# EAGLE design PGTN018_phase_shifter (EAGLE 8.5.2)
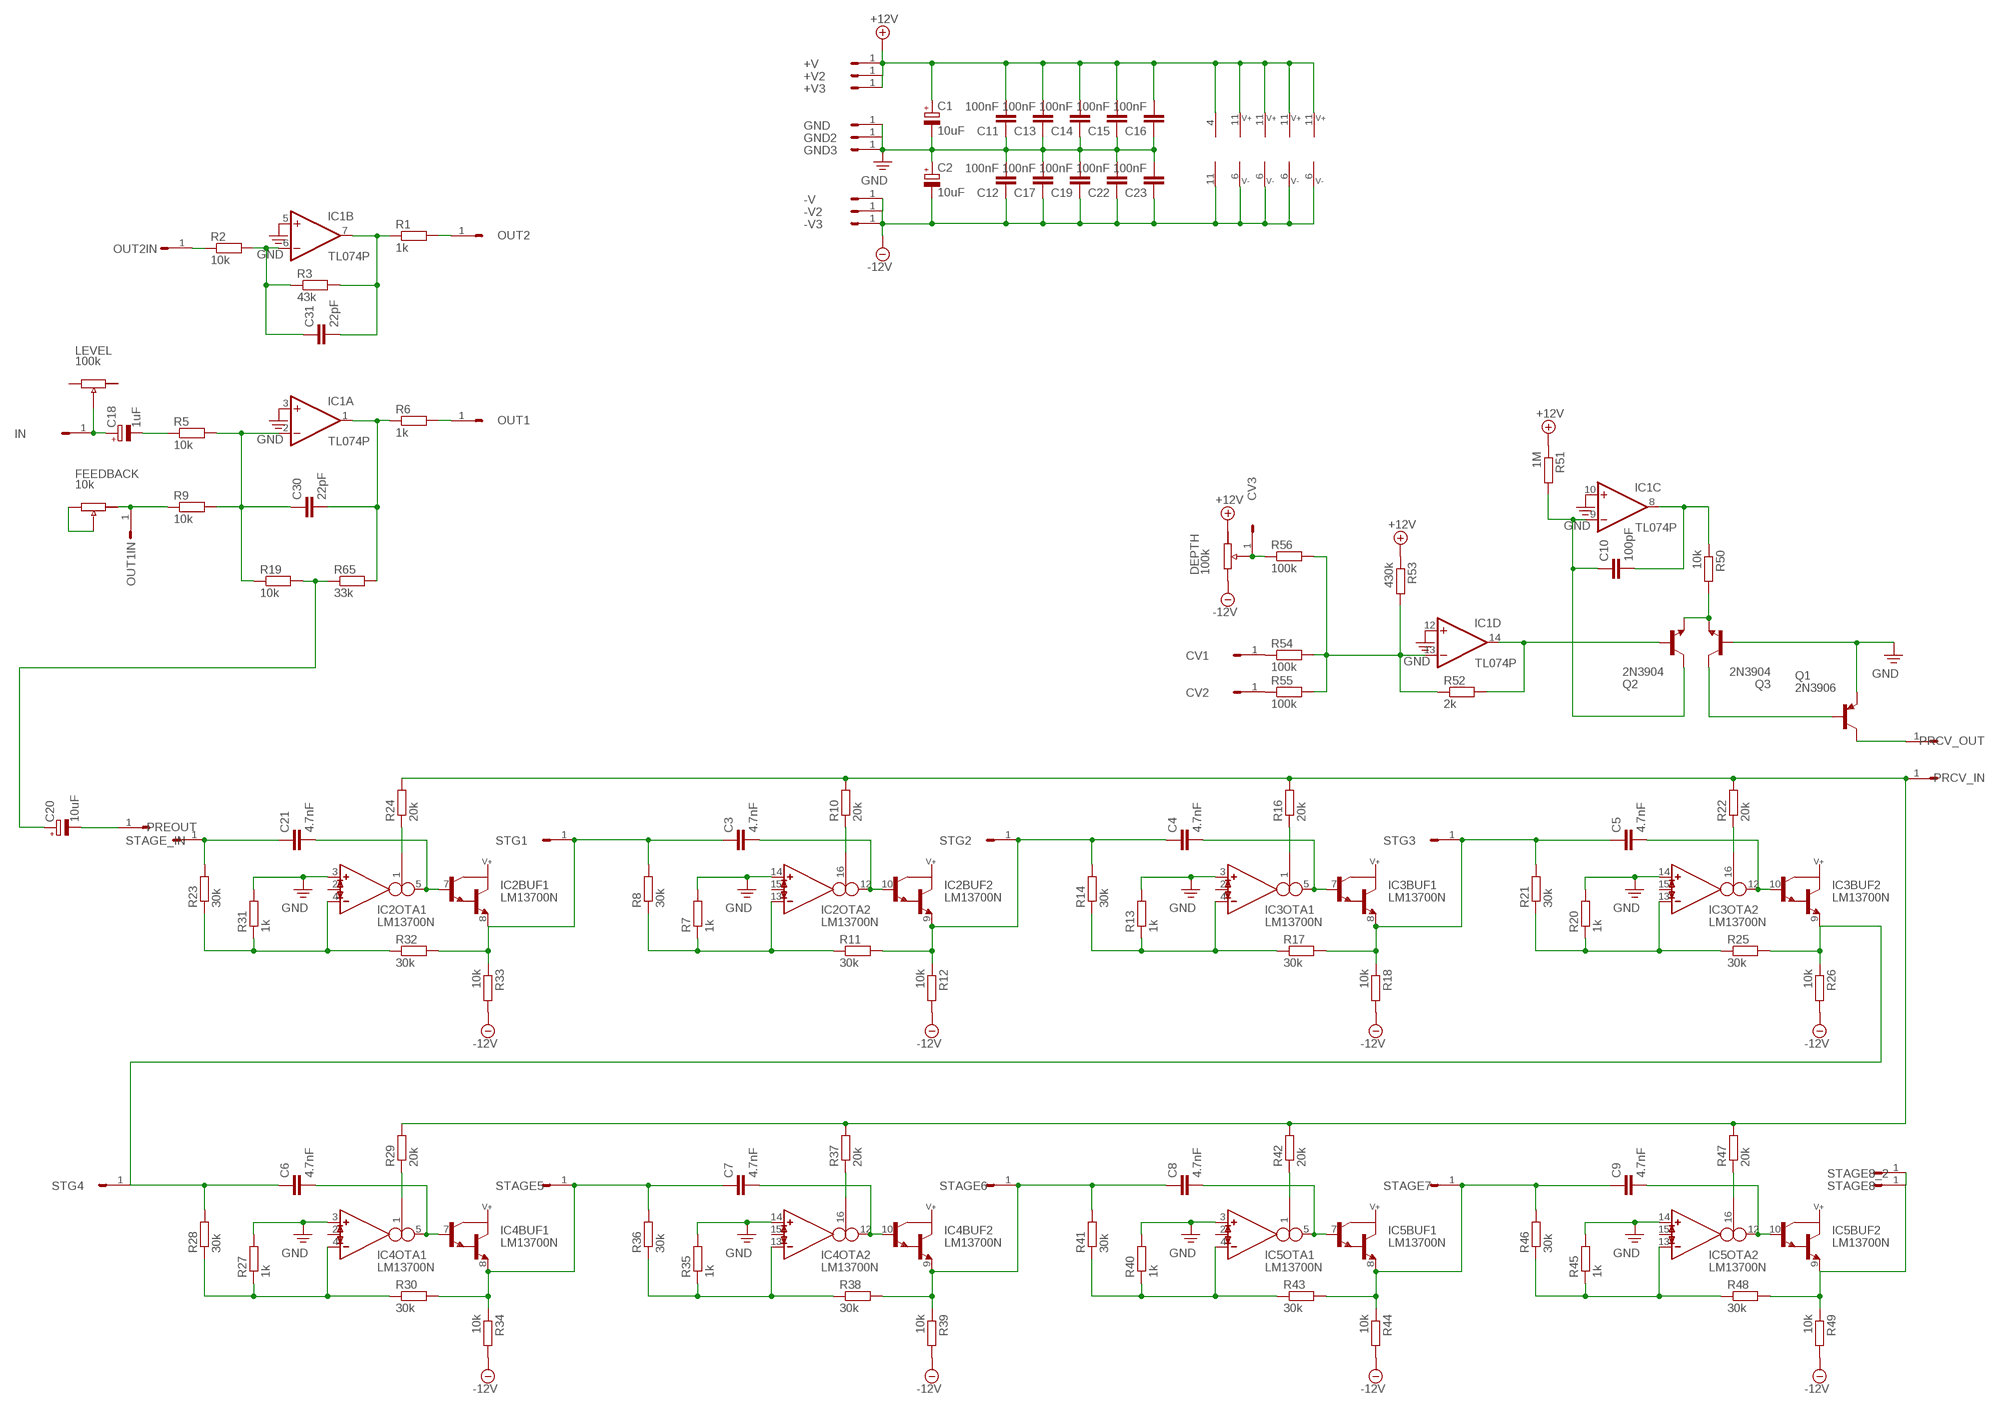
[diagram p0: schematic, sheet 1]

## Parts
+V  HEADER/MALE/01  [HEADER/MALE/01]
+V2  HEADER/MALE/01  [HEADER/MALE/01]
+V3  HEADER/MALE/01  [HEADER/MALE/01]
-V  HEADER/MALE/01  [HEADER/MALE/01]
-V2  HEADER/MALE/01  [HEADER/MALE/01]
-V3  HEADER/MALE/01  [HEADER/MALE/01]
C1  10uF  CAPACITOR/POLARIZEDE2.5-6  [E2,5-6]
C2  10uF  CAPACITOR/POLARIZEDE2.5-6  [E2,5-6]
C3  4.7nF  CAPACITORCERAMICDISC/5  [CERAMICDISC/5]
C4  4.7nF  CAPACITORCERAMICDISC/5  [CERAMICDISC/5]
C5  4.7nF  CAPACITORCERAMICDISC/5  [CERAMICDISC/5]
C6  4.7nF  CAPACITORCERAMICDISC/5  [CERAMICDISC/5]
C7  4.7nF  CAPACITORCERAMICDISC/5  [CERAMICDISC/5]
C8  4.7nF  CAPACITORCERAMICDISC/5  [CERAMICDISC/5]
C9  4.7nF  CAPACITORCERAMICDISC/5  [CERAMICDISC/5]
C10  100pF  CAPACITORCERAMICDISC/5  [CERAMICDISC/5]
C11  100nF  CAPACITORCERAMICDISC/5  [CERAMICDISC/5]
C12  100nF  CAPACITORCERAMICDISC/5  [CERAMICDISC/5]
C13  100nF  CAPACITORCERAMICDISC/5  [CERAMICDISC/5]
C14  100nF  CAPACITORCERAMICDISC/5  [CERAMICDISC/5]
C15  100nF  CAPACITORCERAMICDISC/5  [CERAMICDISC/5]
C16  100nF  CAPACITORCERAMICDISC/5  [CERAMICDISC/5]
C17  100nF  CAPACITORCERAMICDISC/5  [CERAMICDISC/5]
C18  1uF  CAPACITOR/POLARIZEDE2.5-6  [E2,5-6]
C19  100nF  CAPACITORCERAMICDISC/5  [CERAMICDISC/5]
C20  10uF  CAPACITOR/POLARIZEDE2.5-6  [E2,5-6]
C21  4.7nF  CAPACITORCERAMICDISC/5  [CERAMICDISC/5]
C22  100nF  CAPACITORCERAMICDISC/5  [CERAMICDISC/5]
C23  100nF  CAPACITORCERAMICDISC/5  [CERAMICDISC/5]
C30  22pF  CAPACITORCERAMICDISC/5  [CERAMICDISC/5]
C31  22pF  CAPACITORCERAMICDISC/5  [CERAMICDISC/5]
CV1  HEADER/MALE/01  [HEADER/MALE/01]
CV2  HEADER/MALE/01  [HEADER/MALE/01]
CV3  HEADER/MALE/01  [HEADER/MALE/01]
DEPTH  100k  POTENTIOMETER  (no package)
FEEDBACK  10k  POTENTIOMETER  (no package)
GND  HEADER/MALE/01  [HEADER/MALE/01]
GND2  HEADER/MALE/01  [HEADER/MALE/01]
GND3  HEADER/MALE/01  [HEADER/MALE/01]
IC1  TL074P  [DIL14]
IC2  LM13700N  [DIL16]
IC3  LM13700N  [DIL16]
IC4  LM13700N  [DIL16]
IC5  LM13700N  [DIL16]
IN  HEADER/MALE/01  [HEADER/MALE/01]
LEVEL  100k  POTENTIOMETER  (no package)
OUT1  HEADER/MALE/01  [HEADER/MALE/01]
OUT1IN  HEADER/MALE/01  [HEADER/MALE/01]
OUT2  HEADER/MALE/01  [HEADER/MALE/01]
OUT2IN  HEADER/MALE/01  [HEADER/MALE/01]
PRCV_IN  HEADER/MALE/01  [HEADER/MALE/01]
PRCV_OUT  HEADER/MALE/01  [HEADER/MALE/01]
PREOUT  HEADER/MALE/01  [HEADER/MALE/01]
Q1  2N3906  [TO92]
Q2  2N3904  [TO92]
Q3  2N3904  [TO92]
R1  1k  RESISTORRESISTOR/UPRIGHT/7.5  [RESISTOR/7.5]
R2  10k  RESISTORRESISTOR/UPRIGHT/7.5  [RESISTOR/7.5]
R3  43k  RESISTORRESISTOR/UPRIGHT/7.5  [RESISTOR/7.5]
R5  10k  RESISTORRESISTOR/UPRIGHT/7.5  [RESISTOR/7.5]
R6  1k  RESISTORRESISTOR/UPRIGHT/7.5  [RESISTOR/7.5]
R7  1k  RESISTORRESISTOR/UPRIGHT/7.5  [RESISTOR/7.5]
R8  30k  RESISTORRESISTOR/UPRIGHT/7.5  [RESISTOR/7.5]
R9  10k  RESISTORRESISTOR/UPRIGHT/7.5  [RESISTOR/7.5]
R10  20k  RESISTORRESISTOR/UPRIGHT/7.5  [RESISTOR/7.5]
R11  30k  RESISTORRESISTOR/UPRIGHT/7.5  [RESISTOR/7.5]
R12  10k  RESISTORRESISTOR/UPRIGHT/7.5  [RESISTOR/7.5]
R13  1k  RESISTORRESISTOR/UPRIGHT/7.5  [RESISTOR/7.5]
R14  30k  RESISTORRESISTOR/UPRIGHT/7.5  [RESISTOR/7.5]
R16  20k  RESISTORRESISTOR/UPRIGHT/7.5  [RESISTOR/7.5]
R17  30k  RESISTORRESISTOR/UPRIGHT/7.5  [RESISTOR/7.5]
R18  10k  RESISTORRESISTOR/UPRIGHT/7.5  [RESISTOR/7.5]
R19  10k  RESISTORRESISTOR/UPRIGHT/7.5  [RESISTOR/7.5]
R20  1k  RESISTORRESISTOR/UPRIGHT/7.5  [RESISTOR/7.5]
R21  30k  RESISTORRESISTOR/UPRIGHT/7.5  [RESISTOR/7.5]
R22  20k  RESISTORRESISTOR/UPRIGHT/7.5  [RESISTOR/7.5]
R23  30k  RESISTORRESISTOR/UPRIGHT/7.5  [RESISTOR/7.5]
R24  20k  RESISTORRESISTOR/UPRIGHT/7.5  [RESISTOR/7.5]
R25  30k  RESISTORRESISTOR/UPRIGHT/7.5  [RESISTOR/7.5]
R26  10k  RESISTORRESISTOR/UPRIGHT/7.5  [RESISTOR/7.5]
R27  1k  RESISTORRESISTOR/UPRIGHT/7.5  [RESISTOR/7.5]
R28  30k  RESISTORRESISTOR/UPRIGHT/7.5  [RESISTOR/7.5]
R29  20k  RESISTORRESISTOR/UPRIGHT/7.5  [RESISTOR/7.5]
R30  30k  RESISTORRESISTOR/UPRIGHT/7.5  [RESISTOR/7.5]
R31  1k  RESISTORRESISTOR/UPRIGHT/7.5  [RESISTOR/7.5]
R32  30k  RESISTORRESISTOR/UPRIGHT/7.5  [RESISTOR/7.5]
R33  10k  RESISTORRESISTOR/UPRIGHT/7.5  [RESISTOR/7.5]
R34  10k  RESISTORRESISTOR/UPRIGHT/7.5  [RESISTOR/7.5]
R35  1k  RESISTORRESISTOR/UPRIGHT/7.5  [RESISTOR/7.5]
R36  30k  RESISTORRESISTOR/UPRIGHT/7.5  [RESISTOR/7.5]
R37  20k  RESISTORRESISTOR/UPRIGHT/7.5  [RESISTOR/7.5]
R38  30k  RESISTORRESISTOR/UPRIGHT/7.5  [RESISTOR/7.5]
R39  10k  RESISTORRESISTOR/UPRIGHT/7.5  [RESISTOR/7.5]
R40  1k  RESISTORRESISTOR/UPRIGHT/7.5  [RESISTOR/7.5]
R41  30k  RESISTORRESISTOR/UPRIGHT/7.5  [RESISTOR/7.5]
R42  20k  RESISTORRESISTOR/UPRIGHT/7.5  [RESISTOR/7.5]
R43  30k  RESISTORRESISTOR/UPRIGHT/7.5  [RESISTOR/7.5]
R44  10k  RESISTORRESISTOR/UPRIGHT/7.5  [RESISTOR/7.5]
R45  1k  RESISTORRESISTOR/UPRIGHT/7.5  [RESISTOR/7.5]
R46  30k  RESISTORRESISTOR/UPRIGHT/7.5  [RESISTOR/7.5]
R47  20k  RESISTORRESISTOR/UPRIGHT/7.5  [RESISTOR/7.5]
R48  30k  RESISTORRESISTOR/UPRIGHT/7.5  [RESISTOR/7.5]
R49  10k  RESISTORRESISTOR/UPRIGHT/7.5  [RESISTOR/7.5]
R50  10k  RESISTORRESISTOR/UPRIGHT/7.5  [RESISTOR/7.5]
R51  1M  RESISTORRESISTOR/UPRIGHT/7.5  [RESISTOR/7.5]
R52  2k  RESISTORRESISTOR/UPRIGHT/7.5  [RESISTOR/7.5]
R53  430k  RESISTORRESISTOR/UPRIGHT/7.5  [RESISTOR/7.5]
R54  100k  RESISTORRESISTOR/UPRIGHT/7.5  [RESISTOR/7.5]
R55  100k  RESISTORRESISTOR/UPRIGHT/7.5  [RESISTOR/7.5]
R56  100k  RESISTORRESISTOR/UPRIGHT/7.5  [RESISTOR/7.5]
R65  33k  RESISTORRESISTOR/UPRIGHT/7.5  [RESISTOR/7.5]
STAGE5  HEADER/MALE/01  [HEADER/MALE/01]
STAGE6  HEADER/MALE/01  [HEADER/MALE/01]
STAGE7  HEADER/MALE/01  [HEADER/MALE/01]
STAGE8  HEADER/MALE/01  [HEADER/MALE/01]
STAGE8_2  HEADER/MALE/01  [HEADER/MALE/01]
STAGE_IN  HEADER/MALE/01  [HEADER/MALE/01]
STG1  HEADER/MALE/01  [HEADER/MALE/01]
STG2  HEADER/MALE/01  [HEADER/MALE/01]
STG3  HEADER/MALE/01  [HEADER/MALE/01]
STG4  HEADER/MALE/01  [HEADER/MALE/01]

## Nets
+12V: DEPTH.A R51.1 R53.1
-12V: DEPTH.E R12.2 R18.2 R26.2 R33.2 R34.2 R39.2 R44.2 R49.2
GND: C1.- C2.+ C11.1 C12.2 C13.1 C14.1 C15.1 C16.1 C17.2 C19.2 C22.2 C23.2 GND2.1 GND3.1 GND.1
N$1: OUT2.1 R1.2
N$2: C30.1 IC1.2(A:-IN) R5.2 R9.2 R19.1
N$3: C31.2 IC1.7(B:OUT) R1.1 R3.2
N$4: C31.1 IC1.6(B:-IN) R2.2 R3.1
N$5: C30.2 IC1.1(A:OUT) R6.1 R65.2
N$6: C18.+ IN.1 LEVEL.S
N$7: C18.- R5.1
N$8: OUT1.1 R6.2
N$9: OUT2IN.1 R2.1
N$10: FEEDBACK.A OUT1IN.1 R9.1
N$11: FEEDBACK.E FEEDBACK.S
N$12: C20.+ R19.2 R65.1
N$13: C20.- PREOUT.1
N$14: C21.1 R23.2 STAGE_IN.1
N$15: IC2.4(OTA1:IN_N) R23.1 R31.1 R32.1
N$16: C3.1 IC2.8(BUF1:E) R8.2 R32.2 R33.1 STG1.1
N$17: IC2.1(OTA1:I_BIAS) R24.1
N$18: C21.2 IC2.5(OTA1:OUT) IC2.7(BUF1:B)
N$19: IC2.13(OTA2:IN_N) R7.1 R8.1 R11.1
N$20: IC3.4(OTA1:IN_N) R13.1 R14.1 R17.1
N$21: IC2.16(OTA2:I_BIAS) R10.1
N$22: C3.2 IC2.10(BUF2:B) IC2.12(OTA2:OUT)
N$23: C4.1 IC2.9(BUF2:E) R11.2 R12.1 R14.2 STG2.1
N$24: C6.1 IC3.9(BUF2:E) R25.2 R26.1 R28.2 STG4.1
N$25: IC3.1(OTA1:I_BIAS) R16.1
N$26: C4.2 IC3.5(OTA1:OUT) IC3.7(BUF1:B)
N$27: C5.1 IC3.8(BUF1:E) R17.2 R18.1 R21.2 STG3.1
N$28: IC3.13(OTA2:IN_N) R20.1 R21.1 R25.1
N$29: IC3.16(OTA2:I_BIAS) R22.1
N$30: C5.2 IC3.10(BUF2:B) IC3.12(OTA2:OUT)
N$31: PRCV_IN.1 R10.2 R16.2 R22.2 R24.2 R29.2 R37.2 R42.2 R47.2
N$32: IC4.4(OTA1:IN_N) R27.1 R28.1 R30.1
N$33: IC4.1(OTA1:I_BIAS) R29.1
N$34: C6.2 IC4.5(OTA1:OUT) IC4.7(BUF1:B)
N$35: C7.1 IC4.8(BUF1:E) R30.2 R34.1 R36.2 STAGE5.1
N$36: IC4.13(OTA2:IN_N) R35.1 R36.1 R38.1
N$37: IC4.16(OTA2:I_BIAS) R37.1
N$38: C7.2 IC4.10(BUF2:B) IC4.12(OTA2:OUT)
N$39: C8.1 IC4.9(BUF2:E) R38.2 R39.1 R41.2 STAGE6.1
N$40: IC5.4(OTA1:IN_N) R40.1 R41.1 R43.1
N$41: IC5.1(OTA1:I_BIAS) R42.1
N$42: C8.2 IC5.5(OTA1:OUT) IC5.7(BUF1:B)
N$43: C9.1 IC5.8(BUF1:E) R43.2 R44.1 R46.2 STAGE7.1
N$44: IC5.13(OTA2:IN_N) R45.1 R46.1 R48.1
N$45: IC5.16(OTA2:I_BIAS) R47.1
N$46: C9.2 IC5.10(BUF2:B) IC5.12(OTA2:OUT)
N$47: IC5.9(BUF2:E) R48.2 R49.1 STAGE8.1 STAGE8_2.1
N$48: Q2.3(E) Q3.3(E) R50.2
N$49: Q1.2(B) Q3.1(C)
N$50: C10.2 IC1.8(C:OUT) R50.1
N$51: C10.1 IC1.9(C:-IN) Q2.1(C) R51.2
N$52: CV1.1 R54.1
N$53: IC1.14(D:OUT) Q2.2(B) R52.2
N$54: CV2.1 R55.1
N$55: CV3.1 DEPTH.S R56.1
N$56: IC1.13(D:-IN) R52.1 R53.2 R54.2 R55.2 R56.2
N$57: PRCV_OUT.1 Q1.1(C)
PE: IC1.3(A:+IN) IC1.5(B:+IN) IC1.10(C:+IN) IC1.12(D:+IN) IC2.3(OTA1:IN_P) IC2.14(OTA2:IN_P) IC3.3(OTA1:IN_P) IC3.14(OTA2:IN_P) IC4.3(OTA1:IN_P) IC4.14(OTA2:IN_P) IC5.3(OTA1:IN_P) IC5.14(OTA2:IN_P) Q1.3(E) Q3.2(B) R7.2 R13.2 R20.2 R27.2 R31.2 R35.2 R40.2 R45.2 ; supply symbol labelled GND
V+: +V2.1 +V3.1 +V.1 C1.+ C11.2 C13.2 C14.2 C15.2 C16.2 IC1.4(P:V+) IC2.11(SUPPLY:V+) IC3.11(SUPPLY:V+) IC4.11(SUPPLY:V+) IC5.11(SUPPLY:V+) ; supply symbol labelled +12V
V-: -V2.1 -V3.1 -V.1 C2.- C12.1 C17.1 C19.1 C22.1 C23.1 IC1.11(P:V-) IC2.6(SUPPLY:V-) IC3.6(SUPPLY:V-) IC4.6(SUPPLY:V-) IC5.6(SUPPLY:V-) ; supply symbol labelled -12V
Unconnected: IC2.2(OTA1:I_DIODE) IC2.15(OTA2:I_DIODE) IC3.2(OTA1:I_DIODE) IC3.15(OTA2:I_DIODE) IC4.2(OTA1:I_DIODE) IC4.15(OTA2:I_DIODE) IC5.2(OTA1:I_DIODE) IC5.15(OTA2:I_DIODE) LEVEL.A LEVEL.E

## Library data of the parts
+V +V2 +V3 -V -V2 -V3 GND GND2 GND3 = connectors:HEADER/MALE/01; SPICEPREFIX: X
C1 C2 = capacitors:CAPACITOR/POLARIZED: POLARIZED CAPACITOR, European symbol; SPICEPREFIX: C
C3-C17 C19 C21-C23 C30 C31 = capacitors:CAPACITOR: CAPACITOR, European symbol
C18 C20 = capacitors:CAPACITOR/POLARIZED: POLARIZED CAPACITOR, European symbol
CV1-CV3 IN OUT1 OUT1IN OUT2 OUT2IN PRCV_IN PRCV_OUT PREOUT STAGE5-STAGE8 STAGE8_2 STAGE_IN STG1-STG4 = connectors:HEADER/MALE/01
DEPTH FEEDBACK LEVEL = controls_off_brd:POTENTIOMETER: Trimm resistor; _EXTERNAL_: 1
IC1 = ic_analogue:TL074: OP AMP
IC2-IC5 = ic_analogue:LM13700: Dual OTA with buffers
Q1 = transistors:2N3906: PNP Transistor
Q2 Q3 = transistors:2N3904: NPN Transistor
R1-R3 R5-R14 R16-R56 R65 = resistors:RESISTOR: RESISTOR, European symbol

## Board
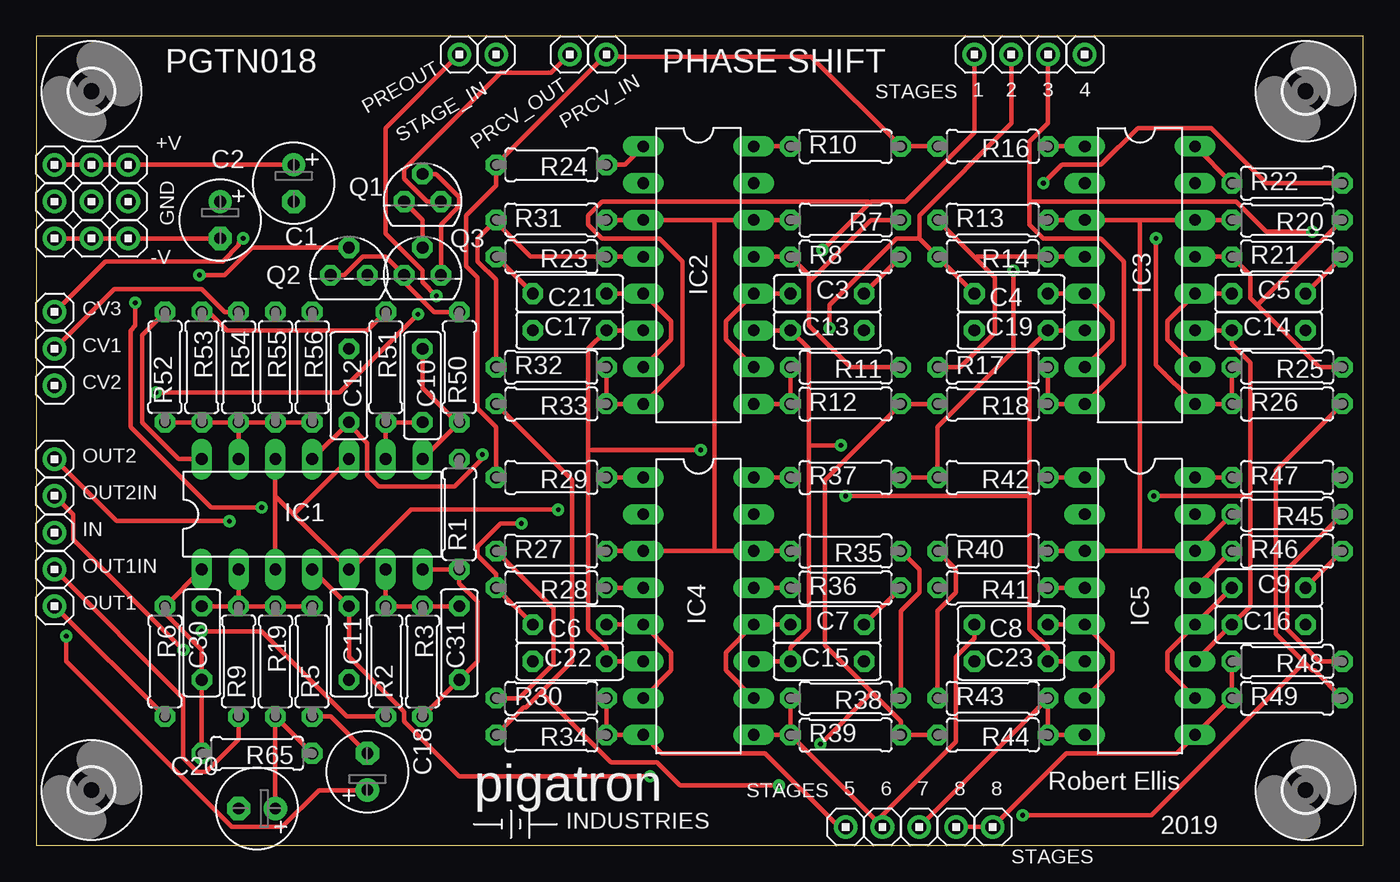
[diagram p1: board, top side]
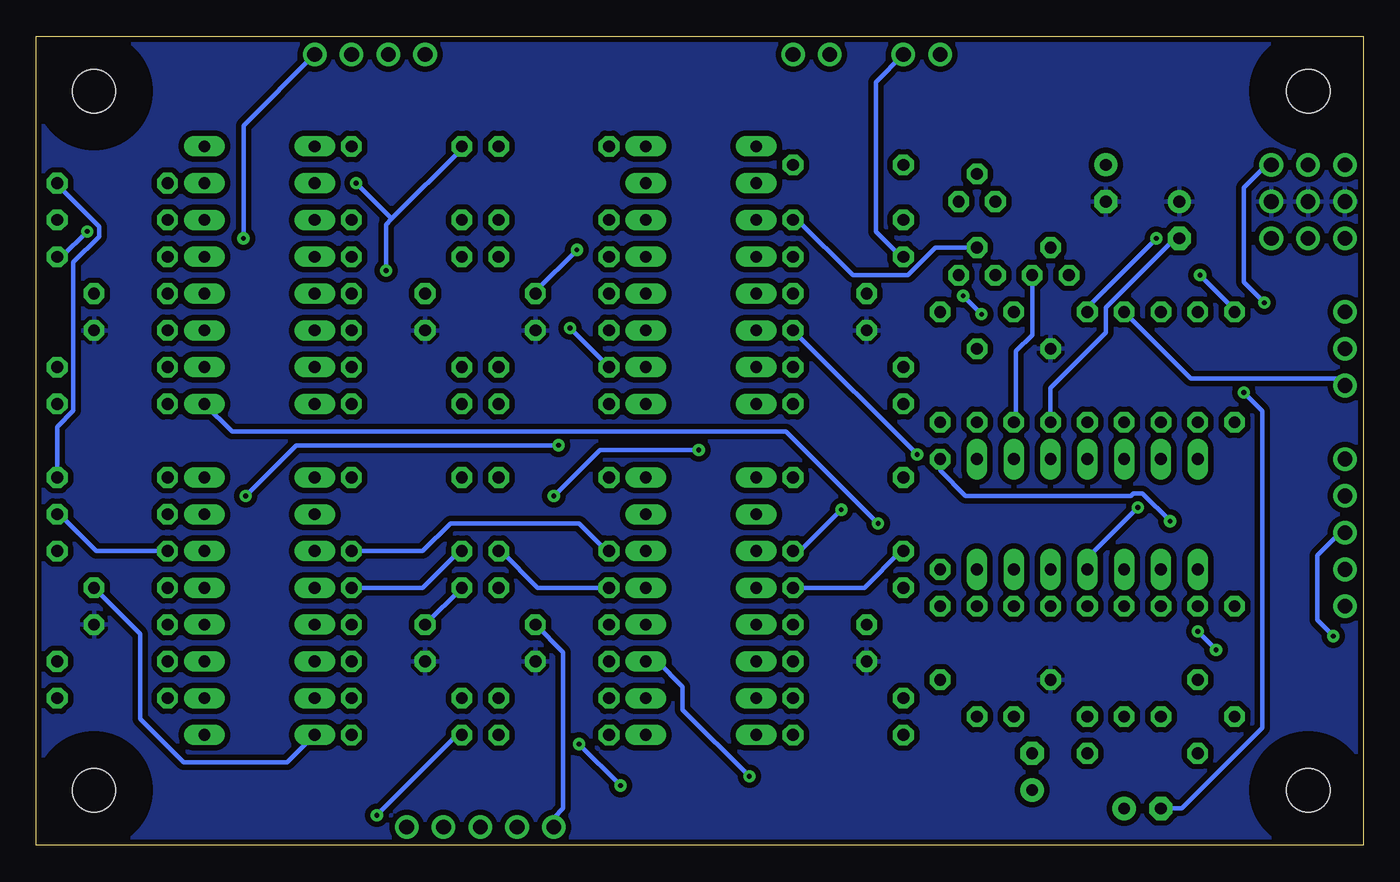
[diagram p2: board, bottom side, seen from below]

Size 91.62 x 55.87 mm. Coordinates in mm from the lower left corner, seen from the top.
Outline: 0,0 91.62,0 91.62,55.87 0,55.87 0,0
Copper layers (1*16): Top 0.0356mm / dielectric 1.5011mm / Bottom 0.0356mm
Design rules "pigatron": minimum track width 12mil, minimum drill 13mil, track to track 15mil, track to pad 10mil, pad to pad 10mil, via to via 10mil, smd to smd 6mil, copper to edge 15mil, drill to drill 10mil, minimum pad ring 12mil, minimum via ring 10mil, stop-mask expansion 4mil, vias tented up to drill 0mil, thermal gap 10mil

### Footprints (pad centres in the part's own frame; a part is rotated, then mirrored left to right if it is on the bottom)
HEADER/MALE/01 = drill 1.016: 1 0,0
E2,5-6 = drill 0.813 pad 1.6: + -1.27,0 | drill 0.813 pad 1.6 octagon: - 1.27,0
CERAMICDISC/5 = drill 0.813 octagon: 1 -2.54,0; 2 2.54,0
DIL14 = drill 0.813 long: 1 -7.62,-3.81; 2 -5.08,-3.81; 3 -2.54,-3.81; 4 0,-3.81; 5 2.54,-3.81; 6 5.08,-3.81; 7 7.62,-3.81; 8 7.62,3.81; 9 5.08,3.81; 10 2.54,3.81; 11 0,3.81; 12 -2.54,3.81; 13 -5.08,3.81; 14 -7.62,3.81
DIL16 = drill 0.813 long: 1 -8.89,-3.81; 2 -6.35,-3.81; 3 -3.81,-3.81; 4 -1.27,-3.81; 5 1.27,-3.81; 6 3.81,-3.81; 7 6.35,-3.81; 8 8.89,-3.81; 9 8.89,3.81; 10 6.35,3.81; 11 3.81,3.81; 12 1.27,3.81; 13 -1.27,3.81; 14 -3.81,3.81; 15 -6.35,3.81; 16 -8.89,3.81
TO92 = drill 0.813 octagon: 1 1.27,0; 2 0,1.905; 3 -1.27,0
RESISTOR/7.5 = drill 0.813 octagon: 1 -3.81,0; 2 3.81,0
STANDOFF/3.0 = hole 3: 0,0

### Placement (x,y rotation side)
+V  6.35,46.99 0 top
+V2  3.81,46.99 0 top
+V3  1.27,46.99 0 top
-V  6.35,41.91 0 top
-V2  3.81,41.91 0 top
-V3  1.27,41.91 0 top
C1  17.78,45.72 270 top
C2  12.7,43.18 270 top
C3  54.61,38.1 180 top
C4  67.31,38.1 0 top
C5  85.09,38.1 180 top
C6  36.83,15.24 0 top
C7  54.61,15.24 180 top
C8  67.31,15.24 0 top
C9  85.09,17.78 180 top
C10  26.67,31.75 90 top
C11  21.59,13.97 90 top
C12  21.59,31.75 90 top
C13  54.61,35.56 180 top
C14  85.09,35.56 180 top
C15  54.61,12.7 180 top
C16  85.09,15.24 180 top
C17  36.83,35.56 180 top
C18  22.86,5.08 90 top
C19  67.31,35.56 180 top
C20  15.24,2.54 180 top
C21  36.83,38.1 0 top
C22  36.83,12.7 180 top
C23  67.31,12.7 180 top
C30  11.43,13.97 270 top
C31  29.21,13.97 270 top
CV1  1.27,34.29 0 top
CV2  1.27,31.75 0 top
CV3  1.27,36.83 0 top
GND  6.35,44.45 0 top
GND2  1.27,44.45 0 top
GND3  3.81,44.45 0 top
IC1  19.05,22.86 0 top
IC2  45.72,39.37 270 top
IC3  76.2,39.37 270 top
IC4  45.72,16.51 270 top
IC5  76.2,16.51 270 top
IN  1.27,21.59 0 top
OUT1  1.27,16.51 0 top
OUT1IN  1.27,19.05 0 top
OUT2  1.27,26.67 0 top
OUT2IN  1.27,24.13 0 top
PRCV_IN  39.37,54.61 270 top
PRCV_OUT  36.83,54.61 180 top
PREOUT  29.21,54.61 180 top
Q1  26.67,44.45 0 top
Q2  21.59,39.37 0 top
Q3  26.67,39.37 0 top
R1  29.21,22.86 90 top
R2  24.13,12.7 90 top
R3  26.67,12.7 270 top
R5  19.05,12.7 90 top
R6  8.89,12.7 270 top
R7  55.88,43.18 180 top
R8  55.88,40.64 0 top
R9  13.97,12.7 90 top
R10  55.88,48.26 0 top
R11  55.88,33.02 180 top
R12  55.88,30.48 0 top
R13  66.04,43.18 0 top
R14  66.04,40.64 180 top
R16  66.04,48.26 180 top
R17  66.04,33.02 0 top
R18  66.04,30.48 180 top
R19  16.51,12.7 270 top
R20  86.36,43.18 180 top
R21  86.36,40.64 0 top
R22  86.36,45.72 0 top
R23  35.56,40.64 180 top
R24  35.56,46.99 180 top
R25  86.36,33.02 180 top
R26  86.36,30.48 0 top
R27  35.56,20.32 0 top
R28  35.56,17.78 180 top
R29  35.56,25.4 180 top
R30  35.56,10.16 0 top
R31  35.56,43.18 0 top
R32  35.56,33.02 0 top
R33  35.56,30.48 180 top
R34  35.56,7.62 180 top
R35  55.88,20.32 180 top
R36  55.88,17.78 0 top
R37  55.88,25.4 0 top
R38  55.88,10.16 180 top
R39  55.88,7.62 0 top
R40  66.04,20.32 0 top
R41  66.04,17.78 180 top
R42  66.04,25.4 180 top
R43  66.04,10.16 0 top
R44  66.04,7.62 180 top
R45  86.36,22.86 180 top
R46  86.36,20.32 0 top
R47  86.36,25.4 0 top
R48  86.36,12.7 180 top
R49  86.36,10.16 0 top
R50  29.21,33.02 90 top
R51  24.13,33.02 270 top
R52  8.89,33.02 90 top
R53  11.43,33.02 270 top
R54  13.97,33.02 270 top
R55  16.51,33.02 270 top
R56  19.05,33.02 270 top
R65  15.24,6.35 180 top
STAGE5  55.88,1.27 90 top
STAGE6  58.42,1.27 90 top
STAGE7  60.96,1.27 90 top
STAGE8  63.5,1.27 90 top
STAGE8_2  66.04,1.27 0 top
STAGE_IN  31.75,54.61 270 top
STG1  64.77,54.61 270 top
STG2  67.31,54.61 270 top
STG3  69.85,54.61 270 top
STG4  72.39,54.61 270 top
U$1  [STANDOFF/3.0]  3.81,52.07 0 top
U$2  [STANDOFF/3.0]  3.81,3.81 0 top
U$3  [STANDOFF/3.0]  87.63,3.81 0 top
U$4  [STANDOFF/3.0]  87.63,52.07 0 top
U$5  [PIGATRON-LOGO]  39.12,3.05 0 top

### Tracks (layer width: path | path; a pad name or v marks a point on that pad's centre or on a via)
+12V
  Top 0.305: R53.1 11.91,36.83 13.18,35.56 22.86,35.56 R51.1
-12V  (via drill 0.33)
  Top 0.305: R34.2 33.66,9.53 33.81,9.53 34.85,10.56 | 34.85,10.56 36.99,12.7 36.99,25.24 R33.2 | R49.2 88.27,12.07 88.11,12.07 87.55,12.62 | 87.55,12.62 85.57,14.61 85.57,25.88 R26.2 | R44.2 R39.2 59.69,8.57 57.71,10.56 | R18.2 R12.2 54.45,25.24 54.45,13.81 57.71,10.56 | 87.55,12.62 76.99,2.06 v68.1,2.06 | 34.85,10.56 39.69,5.71 42.86,5.71 44.45,4.13 v51.28,4.13 | 57.71,10.56 v54.13,6.99
  Bottom 0.305: v68.1,2.06 62.55,7.62 R44.2 | v54.13,6.99 v51.28,4.13
GND
  pour Bottom: 0,55.88 0,0 91.44,0 91.44,55.88
N$1  (via drill 0.33)
  Top 0.305: v13.34,22.38 5.56,22.38 OUT2.1
  Bottom 0.305: R1.2 29.21,25.88 27.46,24.13 16.03,24.13 15.88,24.29 15.24,24.29 v13.34,22.38
N$2
  Top 0.305: R9.2 C30.1 | R9.2 R19.1 R5.2 | R9.2 IC1.2
N$3
  Top 0.305: IC1.7 R1.1 29.21,18.1 30.48,16.83 30.48,12.7 C31.2 R3.2
N$4
  Top 0.305: IC1.6 R2.2 R3.1 C31.1
N$5
  Top 0.305: R65.2 C30.2 11.43,13.49 9.05,15.88 9.05,16.51 R6.1 IC1.1
N$6  (via drill 0.33)
  Top 0.305: C18.+ 19.53,3.81 16.99,1.27 13.49,1.27 2.06,12.7 v2.06,14.45
  Bottom 0.305: v2.06,14.45 3.17,15.56 3.17,20 1.59,21.59 IN.1
N$7
  Top 0.305: R5.1 20.32,8.89 C18.-
N$8
  Top 0.305: OUT1.1 R6.2
N$9  (via drill 0.33)
  Top 0.305: R2.1 21.43,8.89 15.56,14.76 v11.43,14.76 | v10.16,13.49 2.54,21.11 2.54,22.86 OUT2IN.1
  Bottom 0.305: v10.16,13.49 v11.43,14.76
N$10
  Top 0.305: R9.1 13.97,7.3 11.75,5.08 11.11,5.08 10.16,6.03 10.16,10.16 OUT1IN.1
N$12
  Top 0.305: R65.1 R19.2 C20.+
N$13  (via drill 0.33)
  Top 0.305: v8.25,31.27 20.96,31.27 v26.35,36.67 | v27.62,37.94 26.67,38.89 26.67,39.69 24.13,42.23 24.13,49.53 PREOUT.1
  Bottom 0.305: C20.- 12.54,2.54 6.99,8.1 6.99,30 v8.25,31.27 | v27.62,37.94 v26.35,36.67
N$14
  Top 0.305: R23.2 C21.1
  Bottom 0.305: STAGE_IN.1 33.66,52.7 33.66,42.39 31.91,40.64 R23.2
N$15
  Top 0.305: IC2.4 R23.1 34.13,40.64 31.75,43.02 R31.1 30.48,41.91 30.48,40.32 31.75,39.05 R32.1
N$16  (via drill 0.33)
  Top 0.305: R32.2 R33.1 IC2.8 44.61,33.18 44.61,40.32 43.02,41.91 39.05,41.91 38.1,42.86 38.1,43.5 39.05,44.45 57.47,44.45 57.55,44.37 | R8.2 C3.1 | STG1.1 64.77,49.21 60.01,44.45 57.63,44.45 57.55,44.37 | v54.29,41.12 57.55,44.37
  Bottom 0.305: v54.29,41.12 57.15,38.26 C3.1
N$17
  Top 0.305: R24.1 40.64,46.99 IC2.1
N$18
  Top 0.305: IC2.7 43.81,34.92 43.81,36.2 IC2.5 C21.2
N$19
  Top 0.305: IC2.13 R8.1 53.34,39.37 53.34,38.89 | R11.1 56.2,33.02 53.34,35.88 53.34,38.89 | R7.1 57.63,43.18 53.34,38.89
N$20
  Top 0.305: IC3.4 R14.1 64.93,40.64 64.85,40.56 | R17.1 63.82,33.02 66.2,35.4 66.2,39.21 64.85,40.56 | R13.1 64.85,40.56
N$21
  Top 0.305: R10.1 IC2.16
N$22
  Top 0.305: IC2.10 47.62,34.92 47.62,36.2 IC2.12 C3.2
N$23  (via drill 0.33)
  Top 0.305: IC2.9 R12.1 R11.2 | C4.1 R14.2 60.96,41.91 | STG2.1 67.31,49.85 60.96,43.5 60.96,41.91 | v54.77,35.72 54.77,37.31 59.37,41.91 60.96,41.91
  Bottom 0.305: v54.77,35.72 R11.2
N$24  (via drill 0.33)
  Top 0.305: C6.1 R28.2 31.75,18.73 30.48,20 30.48,20.64 32.07,22.23 v33.5,22.23 | R25.2 R26.1 IC3.9 77.31,33.18 v77.31,41.91
  Bottom 0.305: STG4.1 77.31,49.69 v77.31,41.91 | v33.5,22.23 39.85,28.57 78.1,28.57 IC3.9
N$25
  Top 0.305: IC3.1 R16.1
N$26
  Top 0.305: IC3.7 74.29,34.92 74.29,36.2 IC3.5 C4.2
N$27  (via drill 0.33)
  Top 0.305: R21.2 C5.1 | R17.2 R18.1 IC3.8 75.09,33.18 75.09,40.32 73.5,41.91 69.53,41.91 68.58,42.86 68.58,44.45 | STG3.1 69.85,49.85 68.58,48.58 68.58,44.45 | v88.11,42.39 84.93,42.39 82.87,44.45 68.58,44.45
  Bottom 0.305: R21.2 89.85,40.64 v88.11,42.39
N$28
  Top 0.305: IC3.13 R21.1 83.82,39.37 83.82,37.78 84.3,37.31 | R25.1 88.58,33.02 84.3,37.31 | 84.3,37.31 R20.1
N$29
  Top 0.305: R22.1 IC3.16
N$30
  Top 0.305: IC3.10 78.1,34.92 78.1,36.2 IC3.12 C5.2
N$31  (via drill 0.33)
  Top 0.305: R29.2 31.75,28.89 30.48,30.16 30.48,39.21 29.69,40 29.69,43.5 31.75,45.56 R24.2 PRCV_IN.1 39.37,54.45 53.5,54.45 R10.2 R16.2 | R37.2 R42.2 62.23,28.89 67.47,34.13 v67.47,39.69 | R22.2 84.93,45.72 81.12,49.53 76.04,49.53 73.5,46.99 70.8,46.99 v69.53,45.72
  Bottom 0.305: v67.47,39.69 67.47,42.86 67.07,43.26 | 67.07,43.26 62.23,48.1 R16.2 | 67.07,43.26 v69.53,45.72 | R47.2 90.17,28.9 89.05,30.02 89.05,40.27 87.28,42.04 87.28,42.73 90.17,45.62 R22.2
N$32
  Top 0.305: IC4.4 R28.1 | R30.1 33.34,10.16 35.72,12.54 35.72,16.35 R27.1
  Bottom 0.305: R28.1 34.45,17.78 31.91,20.32 R27.1
N$33
  Top 0.305: IC4.1 R29.1
N$34
  Top 0.305: IC4.7 43.81,12.07 43.81,13.34 IC4.5 C6.2
N$35
  Top 0.305: R36.2 C7.1 | R30.2 R34.1 IC4.8 43.18,6.35 50.32,6.35 55.4,1.27 STAGE5.1
  Bottom 0.305: C7.1 55.24,13.34 55.24,2.54 55.88,1.9 STAGE5.1
N$36
  Top 0.305: R36.1 IC4.13 | R38.1 59.69,16.19 60.96,17.46 60.96,19.05 R35.1
  Bottom 0.305: R36.1 56.99,17.78 59.53,20.32 R35.1
N$37
  Top 0.305: R37.1 IC4.16
N$38
  Top 0.305: IC4.10 47.62,12.07 47.62,13.34 IC4.12 C7.2
N$39
  Top 0.305: R39.1 IC4.9 | R39.1 R38.2 | R39.1 STAGE6.1 58.1,1.75 63.5,7.14 63.5,13.02 64.77,14.29 C8.1
  Bottom 0.305: C8.1 R41.2
N$40
  Top 0.305: IC5.4 R41.1 | R43.1 62.23,16.19 63.5,17.46 63.5,19.05 R40.1
  Bottom 0.305: R41.1 64.93,17.78 62.39,20.32 R40.1
N$41
  Top 0.305: IC5.1 R42.1
N$42
  Top 0.305: IC5.7 74.29,12.07 74.29,13.34 IC5.5 C8.2
N$43
  Top 0.305: R46.2 C9.1 | IC5.8 R44.1 R43.2 STAGE7.1
  Bottom 0.305: C9.1 84.45,14.61 84.45,8.73 81.44,5.71 74.29,5.71 IC5.8
N$44
  Top 0.305: R46.1 IC5.13 | R48.1 88.58,12.7 86.36,14.92 86.36,19.05 R45.1
  Bottom 0.305: R46.1 87.47,20.32 90.01,22.86 R45.1
N$45
  Top 0.305: R47.1 IC5.16
N$46
  Top 0.305: IC5.10 78.1,12.07 78.1,13.34 IC5.12 C9.2
N$47
  Top 0.305: STAGE8.1 STAGE8_2.1 71.12,6.35 78.74,6.35 IC5.9 R49.1 R48.2
N$48
  Top 0.305: Q2.3 21.27,39.37 22.54,40.64 24.13,40.64 Q3.3 25.4,38.89 27.46,36.83 R50.2
N$49
  Top 0.305: Q3.1 27.94,42.86 29.21,44.13 29.21,44.77 27.62,46.35 Q1.2
N$50
  Top 0.305: IC1.8 R50.1 29.05,29.21 26.67,31.59 C10.2
N$51
  Top 0.305: IC1.9 R51.2 C10.1
  Bottom 0.305: Q2.1 22.86,35.24 23.97,34.13 23.97,29.37 R51.2
N$52
  Top 0.305: R54.1 13.02,36.83 11.43,38.42 5.4,38.42 CV1.1
N$53  (via drill 0.33)
  Top 0.305: IC1.14 9.84,26.67 7.3,29.21 7.3,35.24 R52.2 | Q2.2 14.92,41.27 13.02,39.37 v11.27,39.37
  Bottom 0.305: v11.27,39.37 8.89,36.99 R52.2
N$54
  Bottom 0.305: R55.1 11.91,32.23 1.75,32.23 CV2.1
N$55  (via drill 0.33)
  Top 0.305: v14.29,41.91 13.97,41.59 13.97,41.43 12.86,40.32 4.76,40.32 CV3.1
  Bottom 0.305: R56.1 19.05,37.15 v14.29,41.91
N$56
  Top 0.305: R52.1 R53.2 R54.2 | R54.2 IC1.13 | R54.2 R55.2 R56.2
N$57
  Top 0.305: Q1.1 26.99,44.45 25.4,46.04 25.4,46.67 32.07,53.34 35.56,53.34 PRCV_OUT.1
PE  (via drill 0.33)
  Top 0.305: R13.2 IC3.3 76.2,43.18 | R20.2 IC3.14 76.2,43.18 | R40.2 IC5.3 76.2,20.32 | R45.2 IC5.14 76.2,20.32 | 76.2,20.32 76.2,43.18 | Q3.2 26.67,43.18 Q1.3 | R31.2 IC2.3 46.83,43.18 | R7.2 IC2.14 46.83,43.18 | IC1.12 16.51,24.13 | 16.51,24.13 IC1.3 | 16.51,24.13 17.78,22.86 | 17.78,22.86 IC1.5 21.59,19.21 21.91,19.21 25.88,23.18 v36.04,23.18 | 17.78,22.86 IC1.10 | R27.2 IC4.3 46.83,20.32 | R35.2 IC4.14 46.83,20.32 | 46.83,20.32 46.83,43.18
  Bottom 0.305: Q3.2 29.53,41.27 31.43,39.37 35.24,39.37 39.05,43.18 R31.2 | v36.04,23.18 38.89,20.32 R27.2 | R40.2 64.93,20.32 63.02,22.23 54.13,22.23 52.23,20.32 R35.2
V+  (via drill 0.33)
  Top 0.305: IC3.11 C14.2 82.55,34.61 83.82,33.34 83.82,24.13 | IC5.11 C16.2 83.82,16.51 83.82,24.13 | +V3.1 +V2.1 +V.1 C1.+ | IC1.4 C11.2 21.59,13.02 25.4,9.21 25.4,8.57 29.21,4.76 v42.39,4.76 | IC4.11 C15.2 52.07,13.65 53.34,14.92 53.34,27.62 | IC2.11 C13.2 53.34,34.29 53.34,27.62 | v6.83,37.46 6.83,35.88 6.51,35.56 6.51,28.89 12.07,23.34 v15.56,23.34 | v77.15,24.13 83.82,24.13 | 53.34,27.62 v55.56,27.62
  Bottom 0.305: v42.39,4.76 46.99,9.37 46.99,10.95 48.74,12.7 IC4.11 | +V.1 6.67,46.99 8.25,45.4 8.25,38.89 v6.83,37.46 | v15.56,23.34 19.05,19.84 IC1.4 | v77.15,24.13 73.66,27.62 v55.56,27.62
V-  (via drill 0.33)
  Top 0.305: IC5.6 C23.1 69.85,13.65 68.58,14.92 68.58,24.13 | IC3.6 C19.1 68.58,34.29 68.58,24.13 | IC4.6 C22.1 39.37,13.65 38.1,14.92 38.1,27.3 | IC2.6 C17.1 38.1,34.29 38.1,27.3 | IC1.11 C12.1 21.59,29.05 22.86,27.78 22.86,25.56 23.65,24.77 28.89,24.77 30.8,26.67 v30.8,26.99 | -V3.1 -V2.1 -V.1 C2.- | v55.88,24.13 68.58,24.13 | 38.1,27.3 v45.88,27.3
  Bottom 0.305: C12.1 21.59,31.59 17.78,35.4 17.78,37.15 13.02,41.91 C2.- | v30.8,26.99 C17.1 | v55.88,24.13 52.7,27.3 v45.88,27.3

### Text on the board
tNames: PGTN018 | PHASE SHIFT | STAGES | 1 | 2 | 3 | 4 | STAGES | 5 | 6 | 7 | 8 | 8 | Robert Ellis | 2019 | STAGES